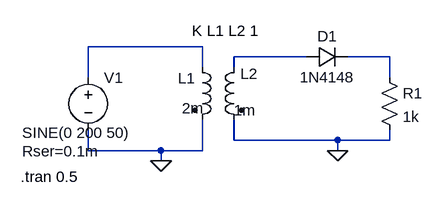
[diagram p0: schematic Half_Wave_Rectifier_LTSPICE.asc]
Half_Wave_Rectifier_LTSPICE.asc, the LTspice schematic file:
Version 4
SHEET 1 880 680
WIRE 240 64 64 64
WIRE 400 80 288 80
WIRE 528 80 464 80
WIRE 240 96 240 64
WIRE 288 96 288 80
WIRE 64 112 64 64
WIRE 528 112 528 80
WIRE 288 208 288 176
WIRE 448 208 288 208
WIRE 528 208 528 192
WIRE 528 208 448 208
WIRE 64 224 64 192
WIRE 176 224 64 224
WIRE 240 224 240 176
WIRE 240 224 176 224
WIRE 448 224 448 208
WIRE 176 240 176 224
FLAG 176 240 0
FLAG 448 224 0
SYMBOL voltage 64 96 R0
WINDOW 3 -102 101 Left 2
WINDOW 123 0 0 Left 0
WINDOW 39 -102 129 Left 2
SYMATTR Value SINE(0 200 50)
SYMATTR SpiceLine Rser=0.1m
SYMATTR InstName V1
SYMBOL diode 400 96 R270
WINDOW 0 32 32 VTop 2
WINDOW 3 0 32 VBottom 2
SYMATTR InstName D1
SYMATTR Value 1N4148
SYMBOL res 512 96 R0
SYMATTR InstName R1
SYMATTR Value 1k
SYMBOL ind2 224 80 R0
WINDOW 0 -22 33 Left 2
WINDOW 3 -16 79 Left 2
SYMATTR InstName L1
SYMATTR Value 2m
SYMATTR Type ind
SYMBOL ind2 304 80 M0
WINDOW 0 -21 26 Left 2
WINDOW 3 -18 82 Left 2
SYMATTR InstName L2
SYMATTR Value 1m
SYMATTR Type ind
TEXT -40 264 Left 2 !.tran 0.5
TEXT 224 40 Left 2 !K L1 L2 1

The netlist it stands for:
* Half_Wave_Rectifier_LTSPICE.asc
V1 N001 0 SINE(0 200 50) Rser=0.1m
D1 N002 N003 1N4148
R1 N003 0 1k
L1 N001 0 2m
L2 N002 0 1m
.model D D
.lib standard.dio
.tran 0.5
K L1 L2 1
.backanno
.end